# Altium schematic sheet STM32L431RCT6.SchDoc
size A; SheetNumber: 1; SheetTotal: 7
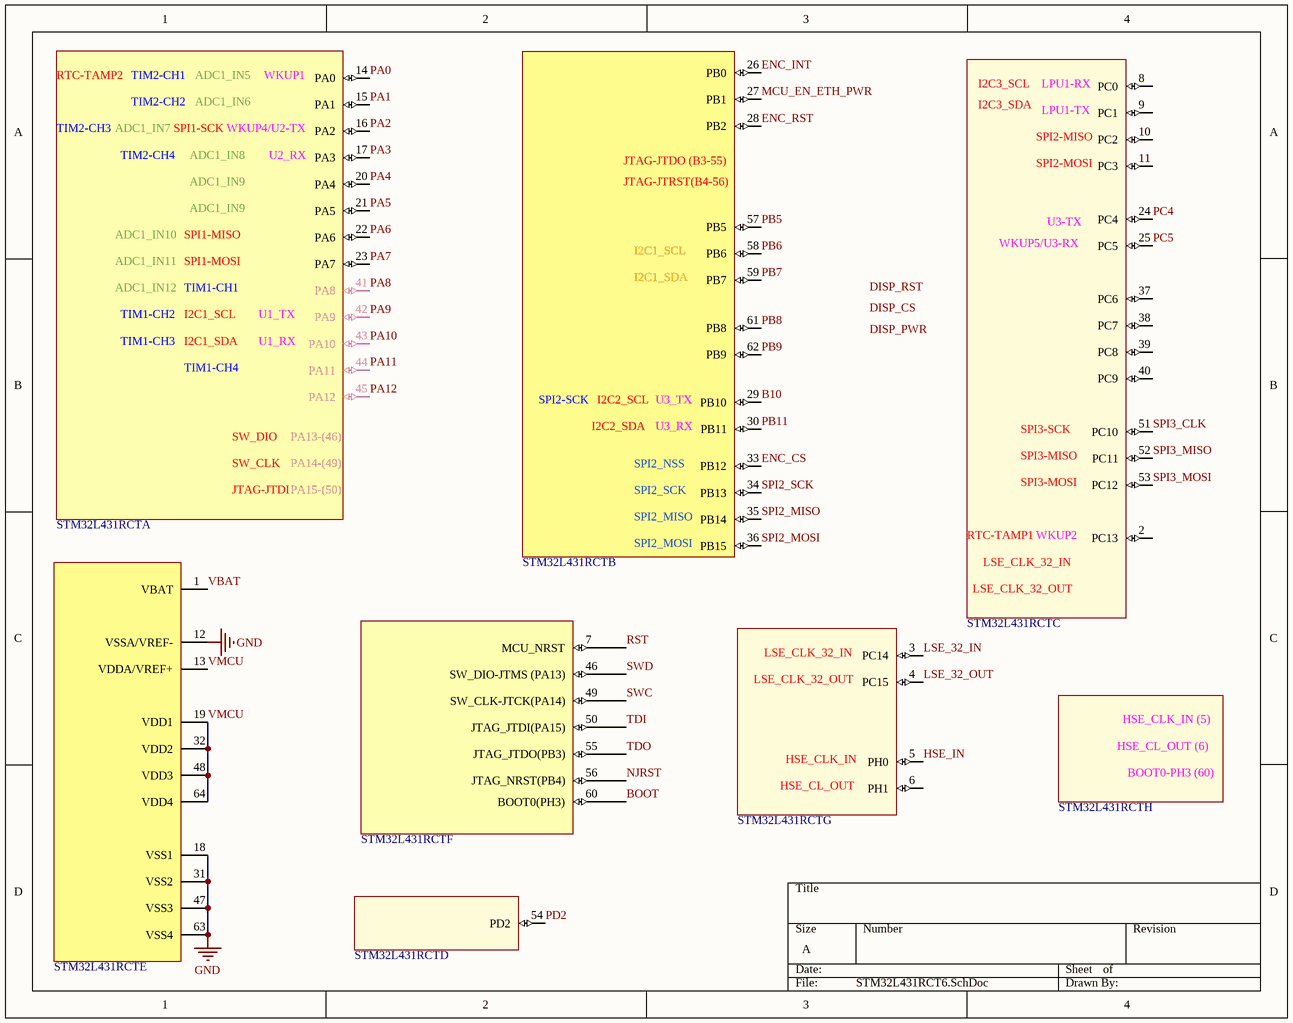
[diagram p0: STM32L431RCT6.SchDoc]

## Parts
STM32L431RCT  STM32L431RCT  [STM32l431RCT6_3d]  (value not drawn)  (parts A,B,C,D,E,F,G,H of 8)

## Nets
GND: STM32L431RCT.12(VSSA/VREF-) STM32L431RCT.18(VSS1) STM32L431RCT.31(VSS2) STM32L431RCT.47(VSS3) STM32L431RCT.63(VSS4)
B10: STM32L431RCT.29(PB10)
BOOT: STM32L431RCT.60(BOOT0(PH3))
ENC_CS: STM32L431RCT.33(PB12)
ENC_INT: STM32L431RCT.26(PB0)
ENC_RST: STM32L431RCT.28(PB2)
HSE_IN: STM32L431RCT.5(PH0)
LSE_32_IN: STM32L431RCT.3(PC14)
LSE_32_OUT: STM32L431RCT.4(PC15)
MCU_EN_ETH_PWR: STM32L431RCT.27(PB1)
NJRST: STM32L431RCT.56(JTAG_NRST(PB4))
PA0: STM32L431RCT.14(PA0)
PA1: STM32L431RCT.15(PA1)
PA2: STM32L431RCT.16(PA2)
PA3: STM32L431RCT.17(PA3)
PA4: STM32L431RCT.20(PA4)
PA5: STM32L431RCT.21(PA5)
PA6: STM32L431RCT.22(PA6)
PA7: STM32L431RCT.23(PA7)
PA8: STM32L431RCT.41(PA8)
PA9: STM32L431RCT.42(PA9)
PA10: STM32L431RCT.43(PA10)
PA11: STM32L431RCT.44(PA11)
PA12: STM32L431RCT.45(PA12)
PB5: STM32L431RCT.57(PB5)
PB6: STM32L431RCT.58(PB6)
PB7: STM32L431RCT.59(PB7)
PB8: STM32L431RCT.61(PB8)
PB9: STM32L431RCT.62(PB9)
PB11: STM32L431RCT.30(PB11)
PC4: STM32L431RCT.24(PC4)
PC5: STM32L431RCT.25(PC5)
PD2: STM32L431RCT.54(PD2)
RST: STM32L431RCT.7(MCU_NRST)
SPI2_MISO: STM32L431RCT.35(PB14)
SPI2_MOSI: STM32L431RCT.36(PB15)
SPI2_SCK: STM32L431RCT.34(PB13)
SPI3_CLK: STM32L431RCT.51(PC10)
SPI3_MISO: STM32L431RCT.52(PC11)
SPI3_MOSI: STM32L431RCT.53(PC12)
SWC: STM32L431RCT.49(SW_CLK-JTCK(PA14))
SWD: STM32L431RCT.46(SW_DIO-JTMS_(PA13))
TDI: STM32L431RCT.50(JTAG_JTDI(PA15))
TDO: STM32L431RCT.55(JTAG_JTDO(PB3))
VBAT: STM32L431RCT.1(VBAT)
VMCU: STM32L431RCT.13(VDDA/VREF+) STM32L431RCT.19(VDD1) STM32L431RCT.32(VDD2) STM32L431RCT.48(VDD3) STM32L431RCT.64(VDD4)

Not connected (* = marked no-connect by the designer): STM32L431RCT 2(PC13) 6(PH1) 8(PC0) 9(PC1) 10(PC2) 11(PC3) 37(PC6) 38(PC7) 39(PC8) 40(PC9)

## Notes on the sheet
- Labels drawn without touching a wire or pin: DISP_CS, DISP_PWR, DISP_RST
- (in symbol STM32L431RCT, part A) RTC-TAMP2; TIM2-CH1; ADC1_IN5; WKUP1; TIM2-CH2; ADC1_IN6; TIM2-CH3; ADC1_IN7; SPI1-SCK; WKUP4/U2-TX; TIM2-CH4; ADC1_IN8; U2_RX; ADC1_IN9; ADC1_IN10; SPI1-MISO; ADC1_IN11; SPI1-MOSI; ADC1_IN12; TIM1-CH1; TIM1-CH2; I2C1_SCL; U1_TX; TIM1-CH3; I2C1_SDA; U1_RX; TIM1-CH4; SW_DIO; PA13-(46); SW_CLK; PA14-(49); JTAG-JTDI; PA15-(50)
- (in symbol STM32L431RCT, part B) JTAG-JTDO (B3-55); JTAG-JTRST(B4-56); I2C1_SCL; I2C1_SDA; SPI2-SCK; I2C2_SCL; U3_TX; I2C2_SDA; U3_RX; SPI2_NSS; SPI2_SCK; SPI2_MISO; SPI2_MOSI
- (in symbol STM32L431RCT, part C) I2C3_SCL; LPU1-RX; I2C3_SDA; LPU1-TX; SPI2-MISO; SPI2-MOSI; U3-TX; WKUP5/U3-RX; SPI3-SCK; SPI3-MISO; SPI3-MOSI; RTC-TAMP1; WKUP2; LSE_CLK_32_IN; LSE_CLK_32_OUT
- (in symbol STM32L431RCT, part G) LSE_CLK_32_IN; LSE_CLK_32_OUT; HSE_CLK_IN; HSE_CL_OUT
- (in symbol STM32L431RCT, part H) HSE_CLK_IN (5); HSE_CL_OUT (6); BOOT0-PH3 (60)